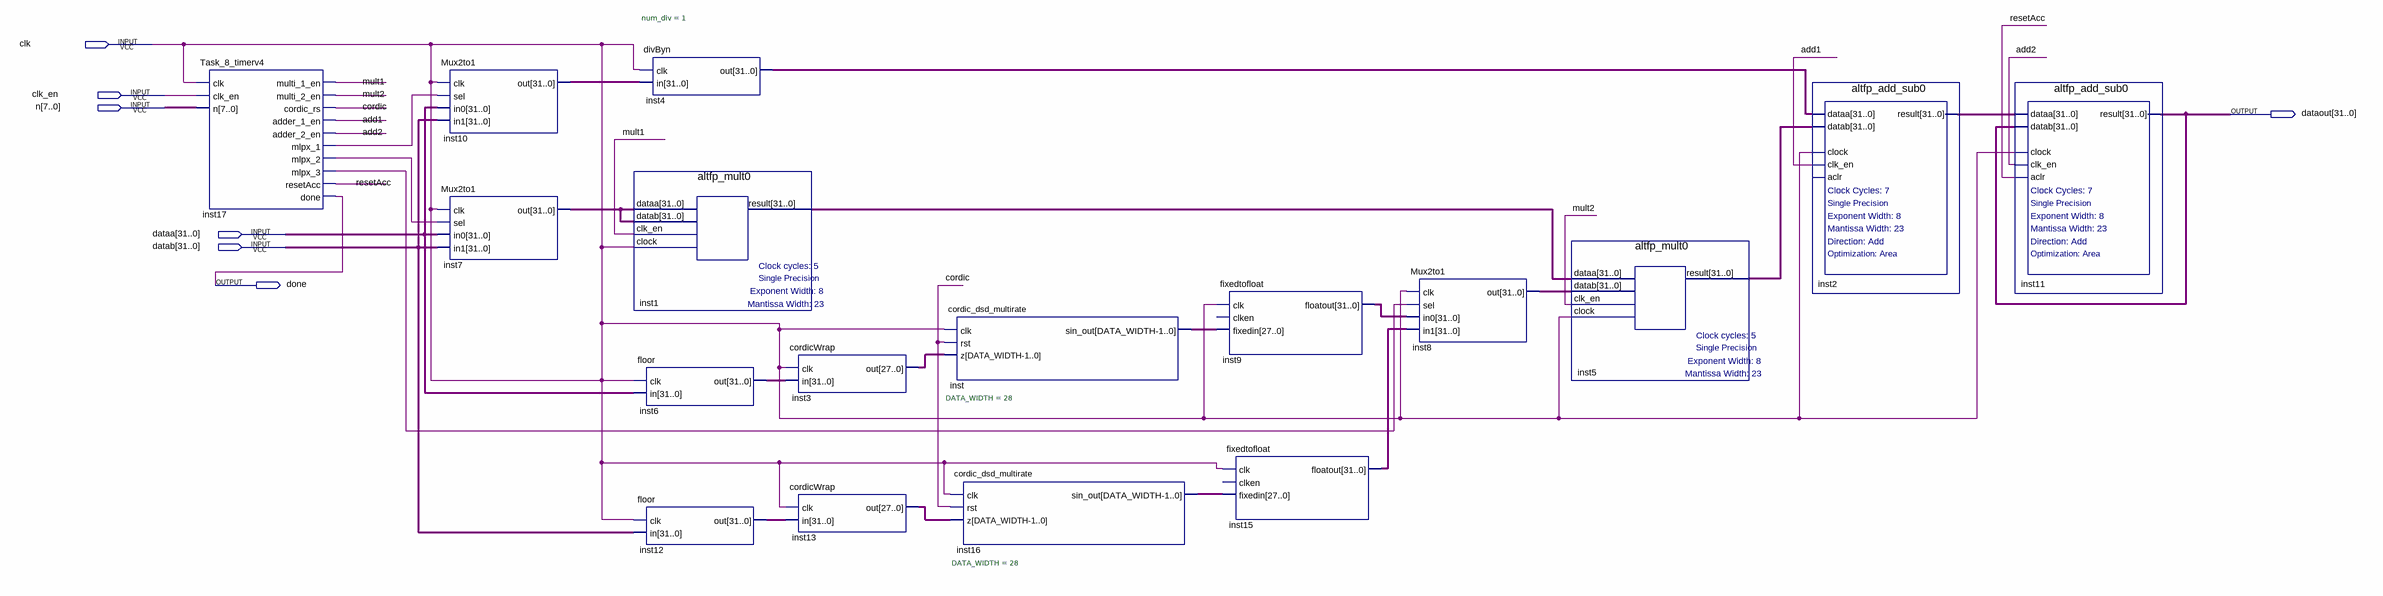
[diagram p0: schematic sheet]
// Quartus schematic task8v4.bdf as structural Verilog: 17 symbols, 7 pins
module task8v4 (
  input  clk,
  input  clk_en,
  input  [7:0] n,
  input  [31:0] dataa,
  input  [31:0] datab,
  output [31:0] dataout,
  output done
);

  wire add1, add2, cordic, inst17_mlpx_1, inst17_mlpx_2, inst17_mlpx_3, mult1, mult2, resetAcc;
  wire [27:0] inst3_out, inst13_out, inst16_sin_out, inst_sin_out;
  wire [31:0] inst1_result, inst2_result, inst4_out, inst5_result, inst6_out, inst7_out, inst8_out,
       inst9_floatout, inst10_out, inst12_out, inst15_floatout;

  Task_8_timerv4 inst17 (
    .clk(clk), .clk_en(clk_en), .n(n), .multi_1_en(mult1), .multi_2_en(mult2), .cordic_rs(cordic),
    .adder_1_en(add1), .adder_2_en(add2), .mlpx_1(inst17_mlpx_1), .mlpx_2(inst17_mlpx_2),
    .mlpx_3(inst17_mlpx_3), .resetAcc(resetAcc), .done(done));
  Mux2to1 inst10 (.clk(clk), .sel(inst17_mlpx_1), .in0(dataa), .in1(datab), .out(inst10_out));
  Mux2to1 inst7 (.clk(clk), .sel(inst17_mlpx_2), .in0(dataa), .in1(datab), .out(inst7_out));
  divByn #(.num_div(1)) inst4 (.clk(clk), .in(inst10_out), .out(inst4_out));
  altfp_mult0 inst1 (.dataa(inst7_out), .datab(inst7_out), .clk_en(mult1), .clock(clk), .result(inst1_result));
  floor inst6 (.clk(clk), .in(dataa), .out(inst6_out));
  floor inst12 (.clk(clk), .in(datab), .out(inst12_out));
  cordicWrap inst3 (.clk(clk), .in(inst6_out), .out(inst3_out));
  cordicWrap inst13 (.clk(clk), .in(inst12_out), .out(inst13_out));
  cordic_dsd_multirate #(.DATA_WIDTH(28)) inst (.clk(clk), .rst(cordic), .z(inst3_out), .sin_out(inst_sin_out));
  cordic_dsd_multirate #(.DATA_WIDTH(28)) inst16 (.clk(clk), .rst(cordic), .z(inst13_out), .sin_out(inst16_sin_out));
  fixedtofloat inst9 (.clk(clk), .fixedin(inst_sin_out), .floatout(inst9_floatout));  // open: clken
  fixedtofloat inst15 (.clk(clk), .fixedin(inst16_sin_out), .floatout(inst15_floatout));  // open: clken
  Mux2to1 inst8 (.clk(clk), .sel(inst17_mlpx_3), .in0(inst9_floatout), .in1(inst15_floatout), .out(inst8_out));
  altfp_mult0 inst5 (.dataa(inst1_result), .datab(inst8_out), .clk_en(mult2), .clock(clk), .result(inst5_result));
  altfp_add_sub0 inst2 (
    .dataa(inst4_out), .datab(inst5_result), .clock(clk), .clk_en(add1), .result(inst2_result));  // open: aclr
  altfp_add_sub0 inst11 (
    .dataa(inst2_result), .datab(dataout), .clock(clk), .clk_en(add2), .aclr(resetAcc), .result(dataout));
endmodule
